# EAGLE schematic cyclops_r3p1 (EAGLE 6.4)
Cyclops 3.0 Schematic Cyclops R3.0 High power LED driver Linear current control Optional linear optical power control Built-in DAC Wide bandwidth Appropriate for scientific applications: e.g. fluorescent imaging and optogenetics
DESIGNER: JONATHAN P. NEWMAN; DOC_NUMBER: 1.1; REVISION: 3.1

## Sheet 1 of 4: I/O Interface
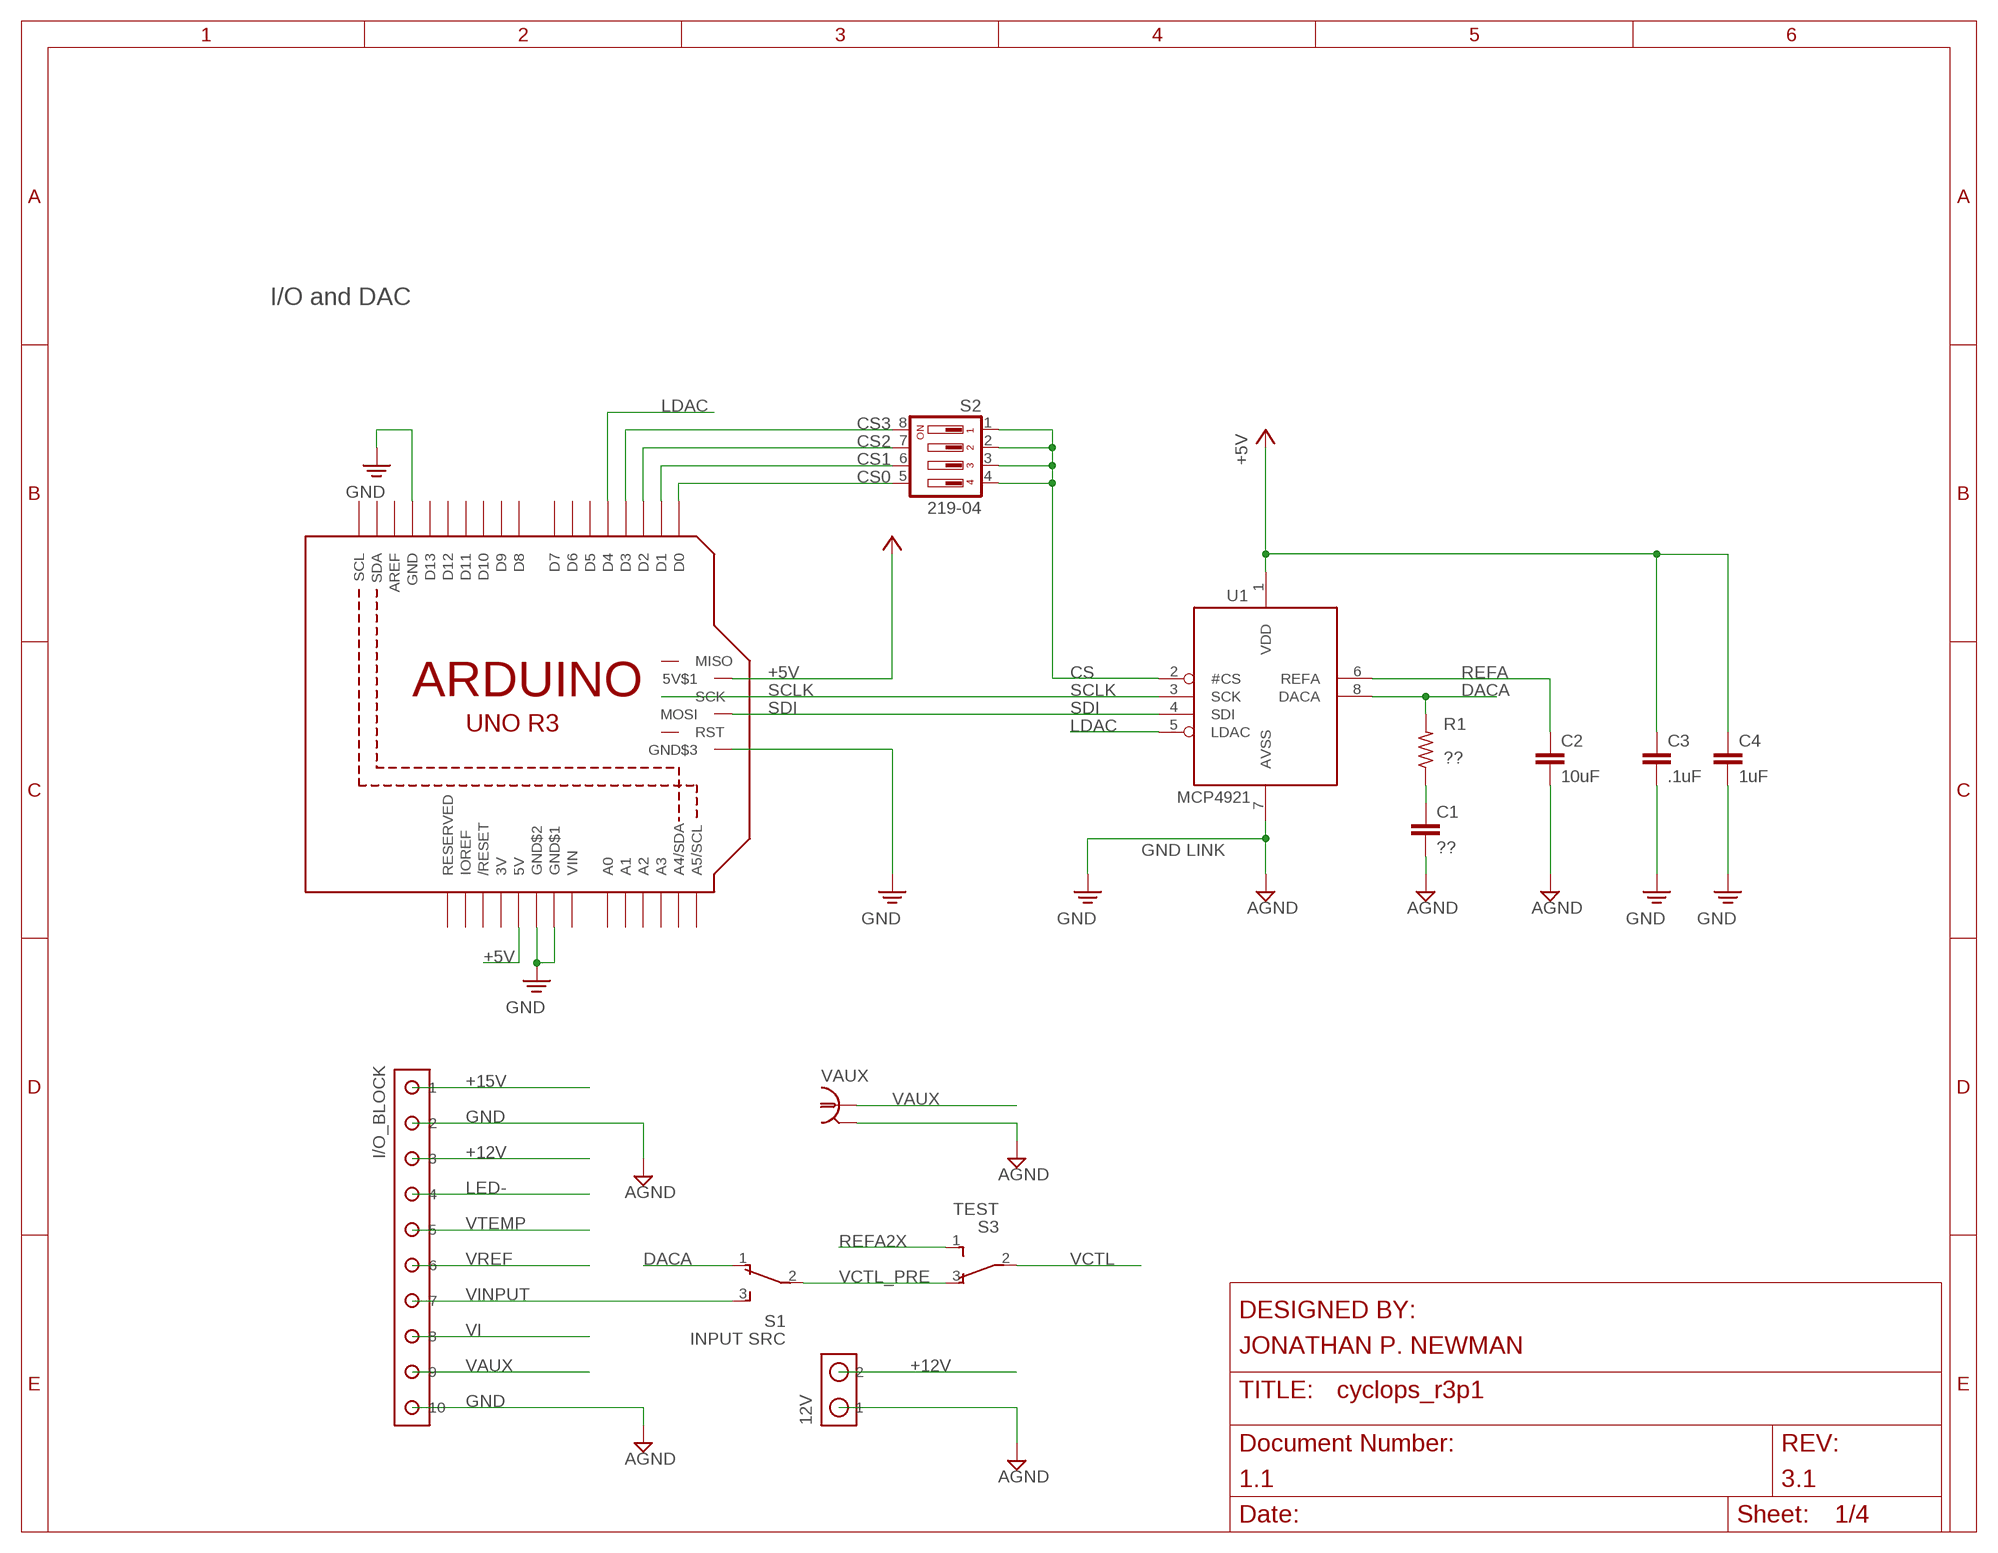
[diagram p0: schematic, sheet 1]

### Parts
12V  SCREW2  [SCREW2]
C1  ??  C_0603  [0603]
C2  10uF  C_0805  [0805]
C3  .1uF  C_0603  [0603]
C4  1uF  C_0805  [0805]
I/O_BLOCK  SCREW10_0.1-THRU  [SCREW10]
R1  ??  R_0603  [0603]
S1  INPUT SRC  SPDT_PCM12  [PCM12]
S2  219-04  [CTS-219-04]
S3  TEST  SPDT_CFPA  [CFPA]
U1  MCP4921  MCP4921SOIC  [SO08]
U$1  ARDUINO_R3_ICSP  [ARDUINOR3_ICSP]
VAUX  BNC_V-BITE  [361V509E]

### Nets
+5V: C3.1 C4.1 U1.1(VDD) U$1.5V(5V$1) U$1.+5V(5V)
+12V [pwr]: 12V.P$2 I/O_BLOCK.P$3 ; also sheet 2,3,4
+15V [pwr]: I/O_BLOCK.P$1 ; also sheet 2
CS: S2.1 S2.2 S2.3 S2.4 U1.2(#CS)
CS0: S2.5 U$1.D0
CS1: S2.6 U$1.D1
CS2: S2.7 U$1.D2
CS3: S2.8 U$1.D3
DACA: R1.2 S1.1 U1.8(DACA)
GND: 12V.P$1 C1.2 C2.2 C3.2 C4.2 I/O_BLOCK.P$2 I/O_BLOCK.P$10 U1.7(AVSS) U$1.GND U$1.GND$1 U$1.GND$2 U$1.GND$3 VAUX.2 VAUX.3 ; supply symbol labelled AGND ; also sheet 2,3,4
LDAC: U1.5(LDAC) U$1.D4
LED-: I/O_BLOCK.P$4 ; also sheet 4
N$1: C1.1 R1.1
REFA: C2.1 U1.6(REFA) ; also sheet 3,4
REFA2X: S3.1 ; also sheet 4
SCLK: U1.3(SCK) U$1.SCK
SDI: U1.4(SDI) U$1.MOSI
VAUX: I/O_BLOCK.P$9 VAUX.1 ; also sheet 4
VCTL: S3.2 ; also sheet 4
VCTL_PRE: S1.2 S3.3
VI: I/O_BLOCK.P$8 ; also sheet 2,4
VINPUT: I/O_BLOCK.P$7 S1.3
VREF: I/O_BLOCK.P$6 ; also sheet 4
VTEMP: I/O_BLOCK.P$5 ; also sheet 3
Unconnected: U$1.A0 U$1.A1 U$1.A2 U$1.A3 U$1.A4(A4/SDA) U$1.A5(A5/SCL) U$1.AREF U$1.D5 U$1.D6 U$1.D7 U$1.D8 U$1.D9 U$1.D10 U$1.D11 U$1.D12 U$1.D13 U$1.IOREF U$1.MISO U$1.RESERVED U$1.RESET$1(RST) U$1.RESET(/RESET) U$1.SCL U$1.SDA

### Notes on the sheet
- I/O and DAC
- GND LINK

## Sheet 2 of 4: Power
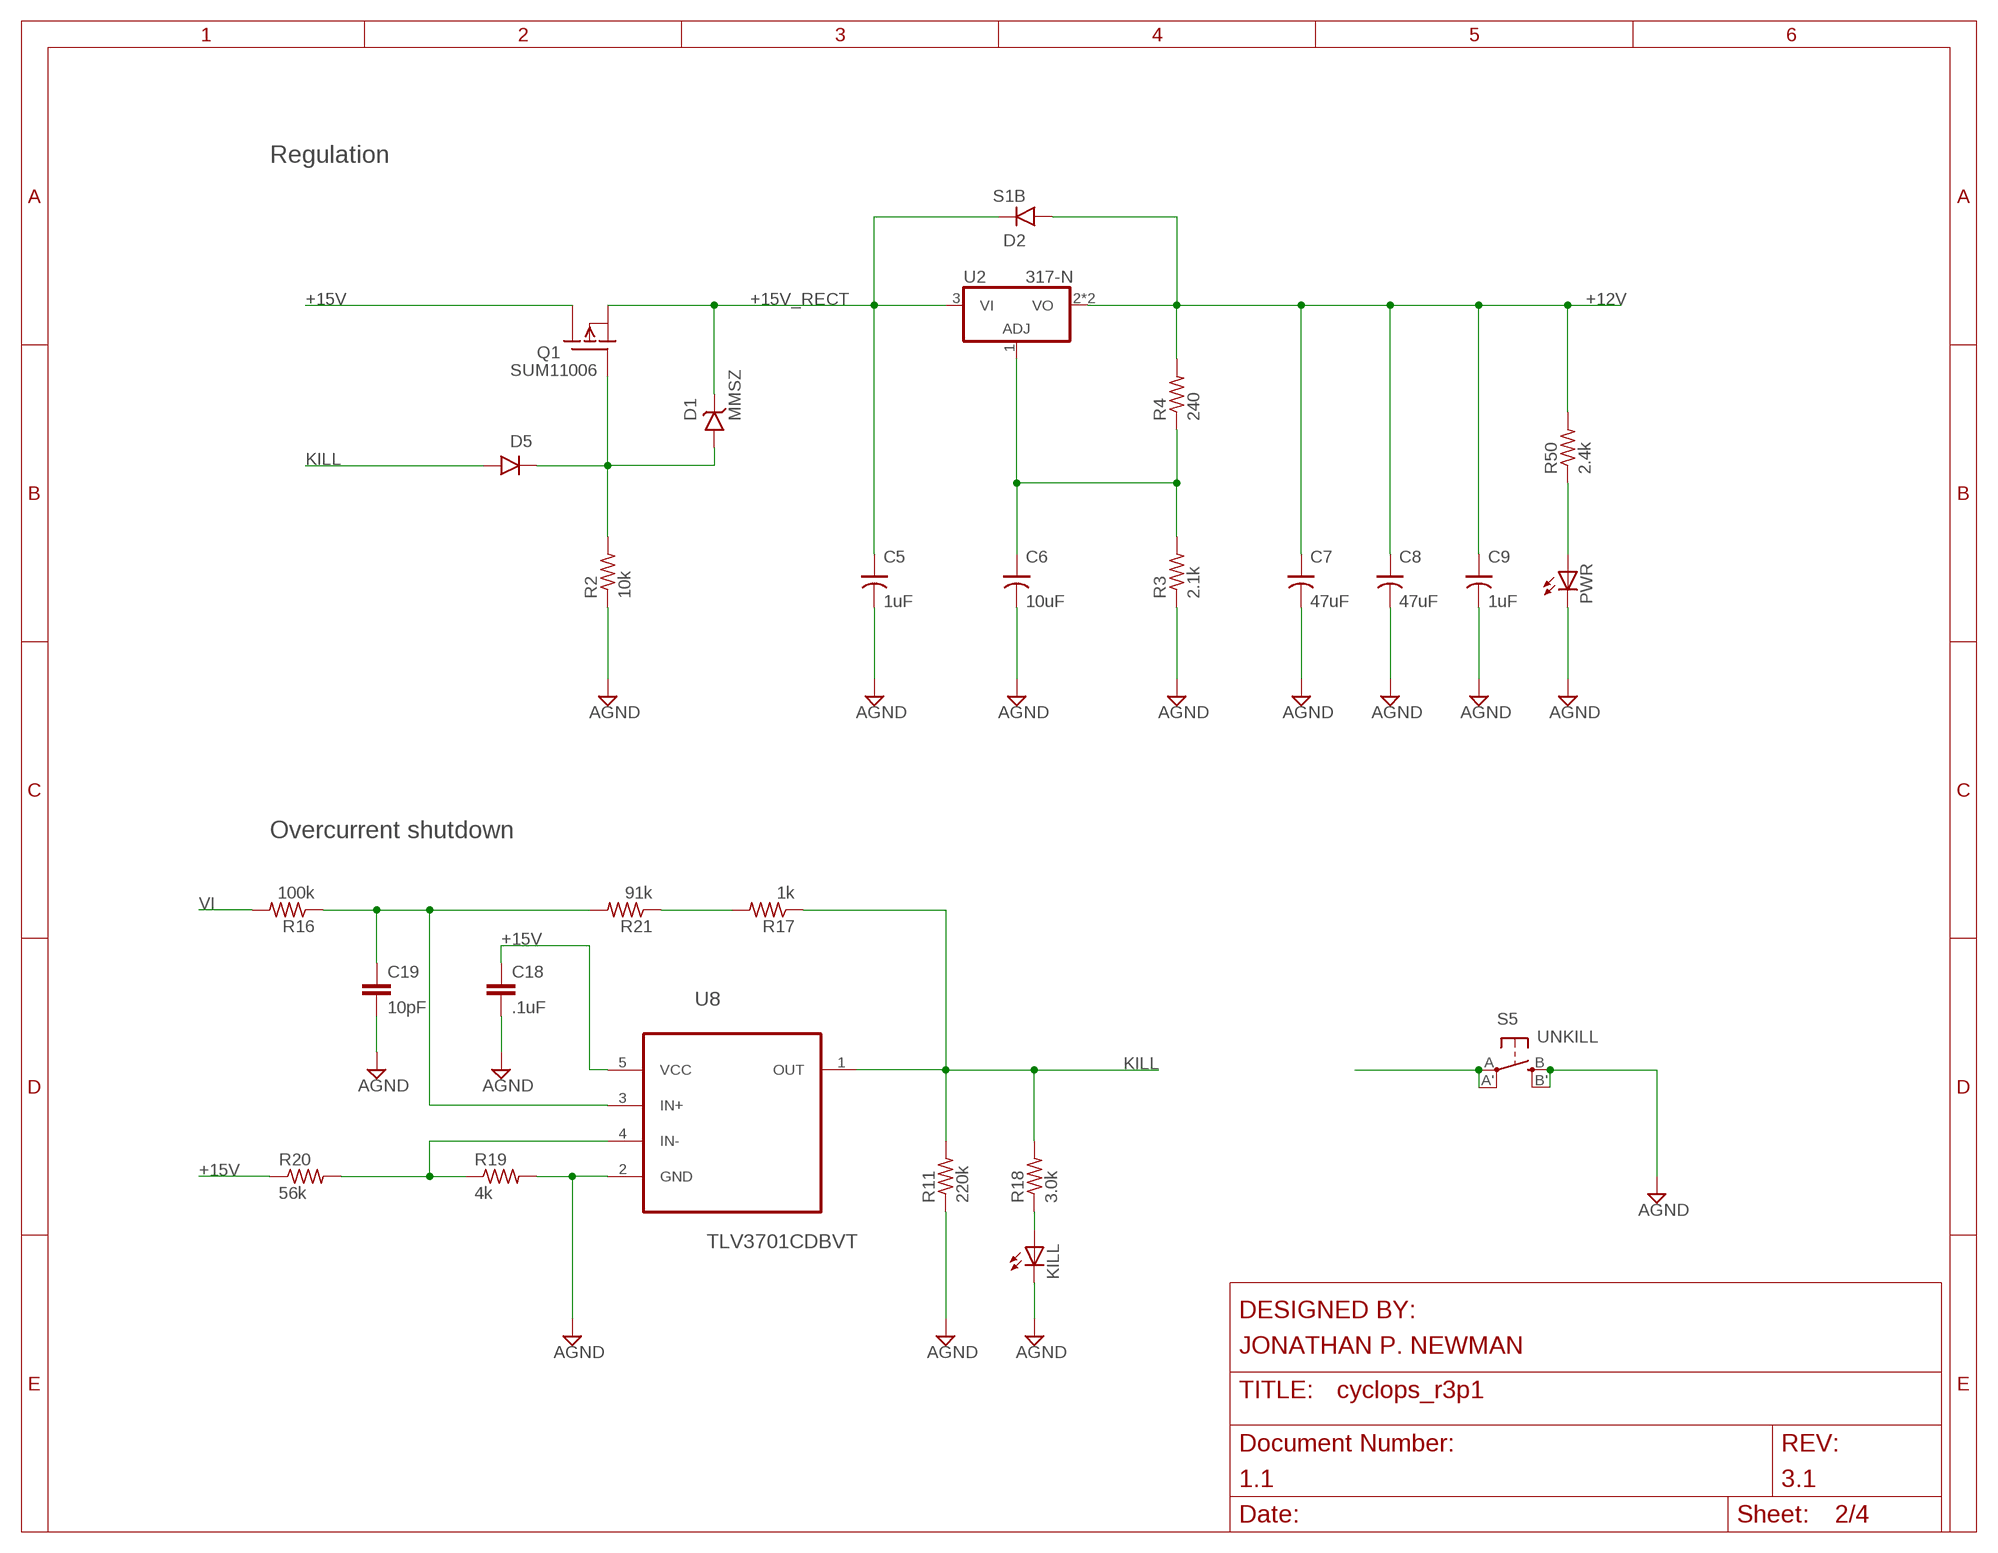
[diagram p1: schematic, sheet 2]

### Parts
C5  1uF  C-POL_1206  [1206-POL]
C6  10uF  C-POL_1206  [1206-POL]
C7  47uF  C-POL_0807  [153CLV-0807]
C8  47uF  C-POL_0807  [153CLV-0807]
C9  1uF  C-POL_1206  [1206-POL]
C18  .1uF  C_0603  [0603]
C19  10pF  C_0603  [0603]
D1  MMSZ  Z-DIODE_MMSZ  [SOD123]
D2  S1B  DIODES1B-13-F  [SMA-DO214AC]
D5  DIODESOD-323  [SOD-323F]
KILL  LEDYELLOW_0805  [CHIP-LED0805]
PWR  LEDYELLOW_0805  [CHIP-LED0805]
Q1  SUM11006  SUM110P06_TO-262  [TO-262_01]
R2  10k  R_0603  [0603]
R3  2.1k  R_0603  [0603]
R4  240  R_0603  [0603]
R11  220k  R_0603  [0603]
R16  100k  R_0603  [0603]
R17  1k  R_0603  [0603]
R18  3.0k  R_0603  [0603]
R19  4k  R_0603  [0603]
R20  56k  R_0603  [0603]
R21  91k  R_0603  [0603]
R50  2.4k  R_0603  [0603]
S5  UNKILL  SPST_TACT-EVQQ2  [EVQ-Q2]
U2  317-N  317_TO263  [TO-263]
U8  TLV3701CDBVT  [SOT95P280X145-5N]

### Nets
+12V [pwr]: C7.+ C8.+ C9.+ D2.A R4.2 R50.2 U2.2(VO) U2.4(VO) ; also sheet 1,3,4
+15V [pwr]: C18.1 Q1.D R20.1 U8.5(VCC) ; also sheet 1
+15V_RECT [pwr]: C5.+ D1.C D2.C Q1.S U2.3(VI)
COMP+: C19.1 R16.1 R21.2 S5.A'(P1) S5.A(P) U8.3(IN+)
GND: C5.- C6.- C7.- C8.- C9.- C18.2 C19.2 KILL.C PWR.C R2.1 R3.1 R11.1 R19.2 S5.B'(S1) S5.B(S) U8.2(GND) ; supply symbol labelled AGND ; also sheet 1,3,4
KILL: D5.A R11.2 R17.1 R18.2 U8.1(OUT)
N$3: PWR.A R50.1
N$5: R19.1 R20.2 U8.4(IN-)
N$9: R17.2 R21.1
N$11: KILL.A R18.1
N$18: D1.A D5.C Q1.G R2.2
N$72: C6.+ R3.2 R4.1 U2.1(ADJ)
VI: R16.2 ; also sheet 1,4

### Notes on the sheet
- Regulation
- Overcurrent shutdown

## Sheet 3 of 4: VREF
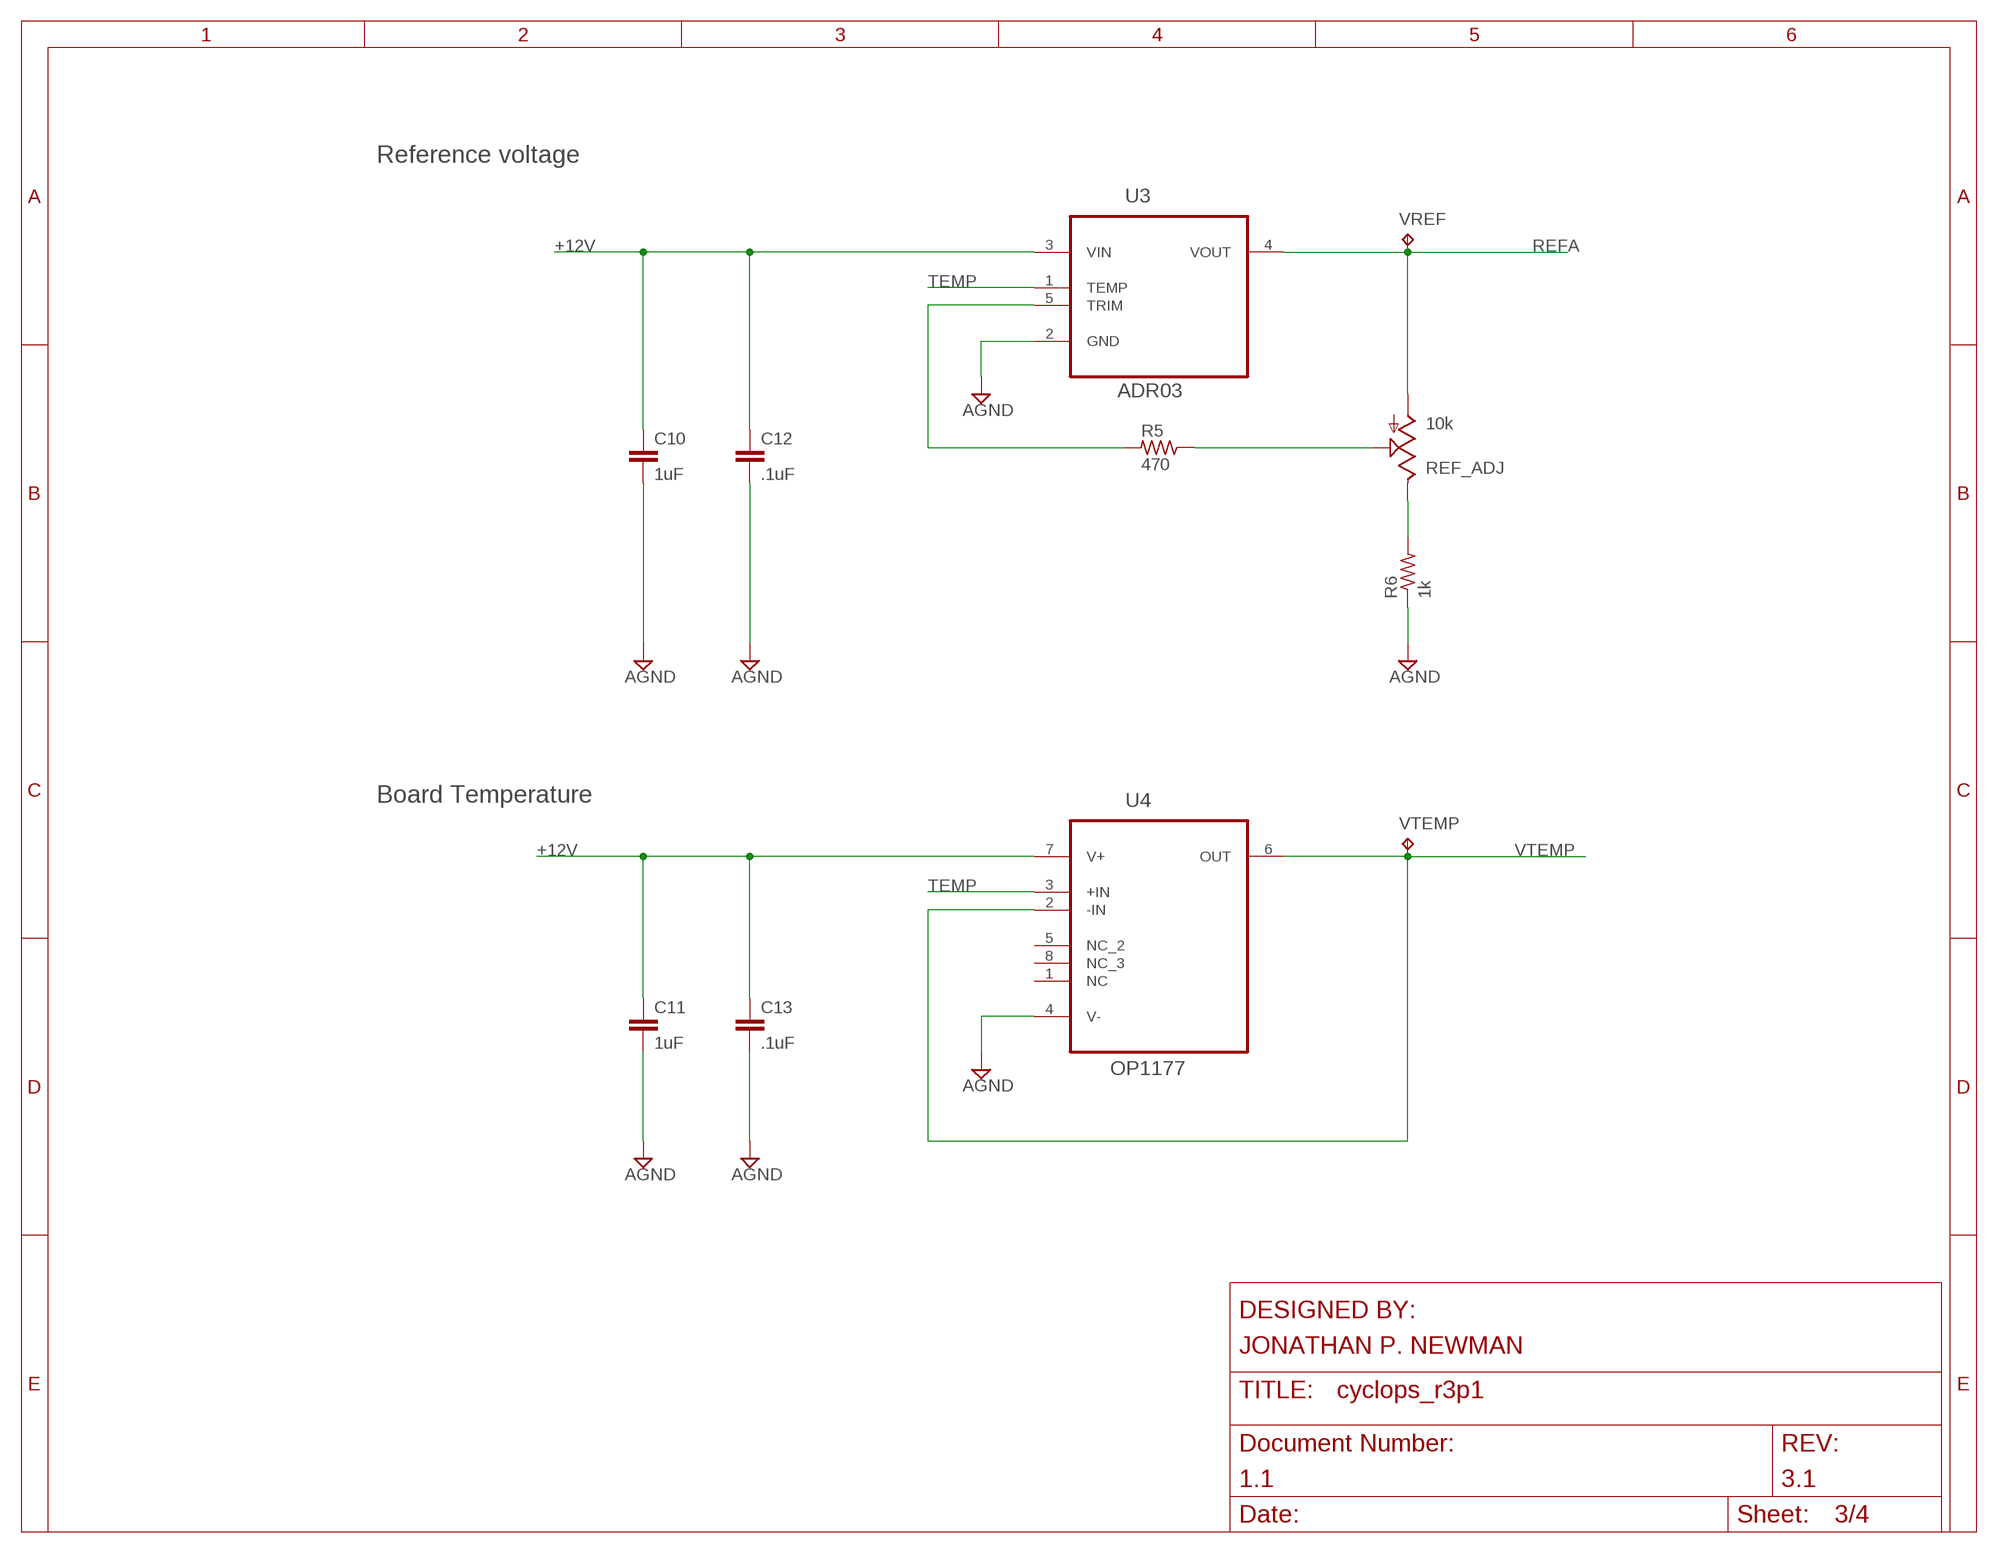
[diagram p2: schematic, sheet 3]

### Parts
C10  1uF  C_0805  [0805]
C11  1uF  C_0805  [0805]
C12  .1uF  C_0603  [0603]
C13  .1uF  C_0603  [0603]
R5  470  R_0603  [0603]
R6  1k  R_0603  [0603]
REF_ADJ  10k  TRIM_US-SM-42/43W  [SM-42/43W]
U3  ADR03  ADR03AKSZ-REEL7  [SOT65P210X110-5N]
U4  OP1177  OP1177ARMZ  [SOP65P490X110-8N]
VREF  TPTP08R  [TP08R]
VTEMP  TPTP08R  [TP08R]

### Nets
+12V [pwr]: C10.1 C11.1 C12.1 C13.1 U3.3(VIN) U4.7(V+) ; also sheet 1,2,4
GND: C10.2 C11.2 C12.2 C13.2 R6.1 U3.2(GND) U4.4(V-) ; supply symbol labelled AGND ; also sheet 1,2,4
N$6: R6.2 REF_ADJ.3(E)
N$20: R5.2 U3.5(TRIM)
N$22: R5.1 REF_ADJ.2(S)
REFA: REF_ADJ.1(A) U3.4(VOUT) VREF.TP ; also sheet 1,4
TEMP: U3.1(TEMP) U4.3(+IN)
VTEMP: U4.2(-IN) U4.6(OUT) VTEMP.TP ; also sheet 1
Unconnected: U4.1(NC) U4.5(NC_2) U4.8(NC_3)

### Notes on the sheet
- Reference voltage
- Board Temperature

## Sheet 4 of 4: DRIVER
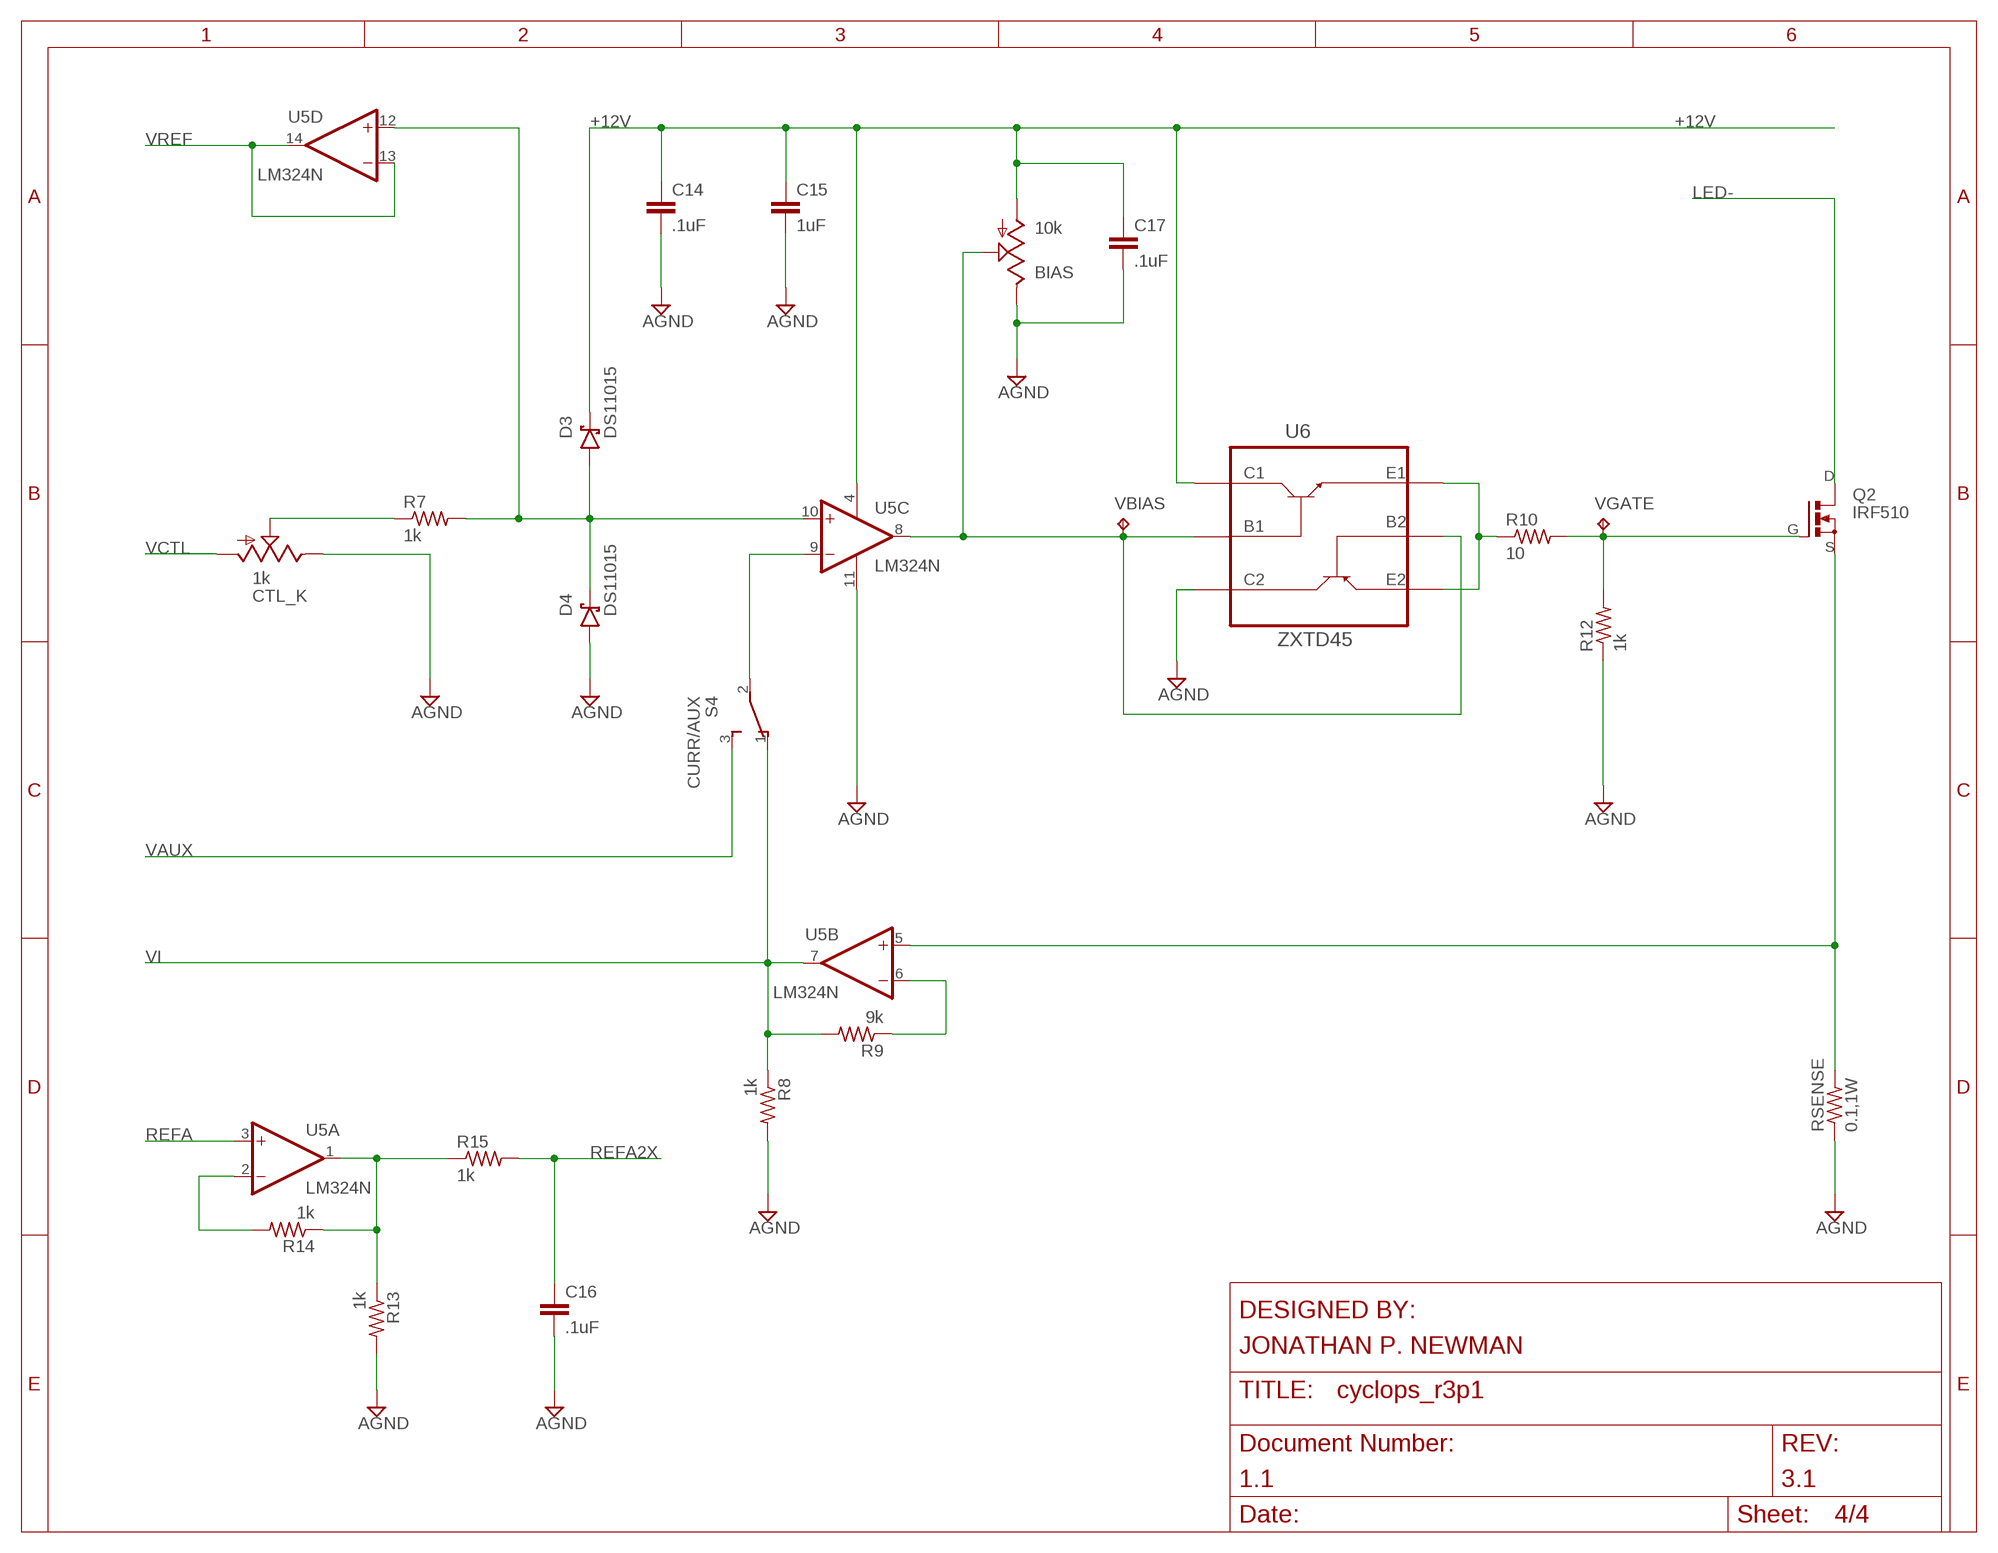
[diagram p3: schematic, sheet 4]

### Parts
BIAS  10k  TRIM_US-SM-42/43W  [SM-42/43W]
C14  .1uF  C_0603  [0603]
C15  1uF  C_0805  [0805]
C16  .1uF  C_0603  [0603]
C17  .1uF  C_0603  [0603]
CTL_K  1k  TRIM_US-SM-42/43A  [SM-42/43A]
D3  DS11015  S-DIODESOD-123  [SOD123]
D4  DS11015  S-DIODESOD-123  [SOD123]
Q2  IRF510  N-MOSFETTO-262  [TO-262_01]
R7  1k  R_0603  [0603]
R8  1k  R_0603  [0603]
R9  9k  R_0603  [0603]
R10  10  R_0603  [0603]
R12  1k  R_0603  [0603]
R13  1k  R_0603  [0603]
R14  1k  R_0603  [0603]
R15  1k  R_0603  [0603]
RSENSE  0.1,1W  R_2512  [2512]
S4  CURR/AUX  SPDT_PCM12  [PCM12]
U5  LM324N  LM324D  [SO14]
U6  ZXTD45  ZXTD4591E6  [SOT23-6]
VBIAS  TPTP08R  [TP08R]
VGATE  TPTP08R  [TP08R]

### Nets
+12V [pwr]: BIAS.1(A) C14.1 C15.1 C17.1 D3.C U5.4(P:V+) U6.1(C1) ; also sheet 1,2,3
_VREF: D3.A D4.C R7.2 U5.10(C:+IN) U5.12(D:+IN)
GND: BIAS.3(E) C14.2 C15.2 C16.2 C17.2 CTL_K.3(E) D4.A R8.2 R12.1 R13.2 RSENSE.1 U5.11(P:V-) U6.3(C2) ; supply symbol labelled AGND ; also sheet 1,2,3
LED-: Q2.D ; also sheet 1
N$2: Q2.S RSENSE.2 U5.5(B:+IN)
N$4: BIAS.2(S) U5.8(C:OUT) U6.2(B1) U6.5(B2) VBIAS.TP
N$7: CTL_K.2(S) R7.1
N$8: R14.2 U5.2(A:-IN)
N$10: R10.1 U6.4(E2) U6.6(E1)
N$13: Q2.G R10.2 R12.2 VGATE.TP
N$15: R9.1 U5.6(B:-IN)
REFA: U5.3(A:+IN) ; also sheet 1,3
REFA2X: C16.1 R15.2 ; also sheet 1
VAUX: S4.3 ; also sheet 1
VCTL: CTL_K.1(A) ; also sheet 1
VFB: S4.2 U5.9(C:-IN)
VI: R8.1 R9.2 S4.1 U5.7(B:OUT) ; also sheet 1,2
VREF: U5.13(D:-IN) U5.14(D:OUT) ; also sheet 1
VREFA2X: R13.1 R14.1 R15.1 U5.1(A:OUT)

## Power pins joined to a net without a drawn wire
3V: U$1.3V
VIN: U$1.VIN

## Library data of the parts
12V = cyclops:SCREW2
BIAS CTL_K REF_ADJ = cyclops:TRIM_US-: POTENTIOMETER
C1 C3 C12-C14 C16-C19 = cyclops:C: Capacitor
C2 C4 C10 C11 C15 = cyclops:C: Capacitor; MN: TDK Corp.; PARTNO: C2012X5R1Cxxxxxxx; VID: DK
C5-C9 = cyclops:C-POL
D1 = cyclops:Z-DIODE
D2 D5 = cyclops:DIODE
D3 D4 = cyclops:S-DIODE
I/O_BLOCK = cyclops:SCREW10
KILL PWR = cyclops:LED; DK: 350-2041-1-ND; MN: 598-8140-107F; MPN: Dialight
Q1 = cyclops:SUM110P06: P-Channel Enhancement MOSFET -60V; 60A; 0,020Ohm
Q2 = cyclops:N-MOSFET: N-CHANNEL MOS FET SYMBOL
R1-R21 R50 = cyclops:R: Resistor; DK: PxxxxHTR-ND; MN: Panasonic; MPN: ERJ-3EKFxxxxV
RSENSE = cyclops:R: Resistor
S1 S3 S4 = cyclops:SPDT
S2 = cyclops:219-04*: Surface Mount DIP Switch Series 219 SMT CTS Electronic Components Sourc: www.ctscorp.com; OC_FARNELL: unknown; OC_NEWARK: unknown
S5 = cyclops:SPST_TACT: SMT 6mm switch, EVQQ2 series http://www.ladyada.net/library/eagle
U1 = cyclops:MCP4921
U2 = cyclops:*317: Positive VOLTAGE REGULATOR
U3 = cyclops:ADR03AKSZ-REEL7: Ultracompact, Precision 10.0 V/5.0 V/2.5 V/3.0 V Voltage References; MPN: ADR03AKSZ-REEL7; OC_FARNELL: 1838919; OC_NEWARK: 59K2675; PACKAGE: SC70-5; SUPPLIER: Analog Devices
U4 = cyclops:OP1177ARMZ: Bias Current Operational Amplifiers; MPN: OP1177ARMZ; OC_FARNELL: 2074880; OC_NEWARK: 22P9695; PACKAGE: MSOP-8; SUPPLIER: Analog Devices
U5 = cyclops:LM324: OP AMP
U6 = cyclops:ZXTD4591E6
U8 = ti-extended:TLV3701CDBVT: FAMILY OF NANOPOWER PUSH-PULL OUTPUT COMPARATORS; MPN: TLV3701CDBVT; OC_FARNELL: 8455538; OC_NEWARK: 76C8790; PACKAGE: SOT-23-5; SUPPLIER: Texas Instruments
U$1 = cyclops:ARDUINO_R3_ICSP
VAUX = cyclops:BNC: BNC CONNECTOR M/A COM www.macom.com distributor Farnell 149-452
VBIAS VGATE VREF VTEMP = cyclops:TP: Test pad